# Altium project Monitor_Board_Model_H201.PrjPcb (part 2 of 3)

## Sheet Membrane_Keypad.SchDoc: Membrane Keypad Interface
size A4; DocumentNumber: 13; SheetNumber: 13; SheetTotal: 31
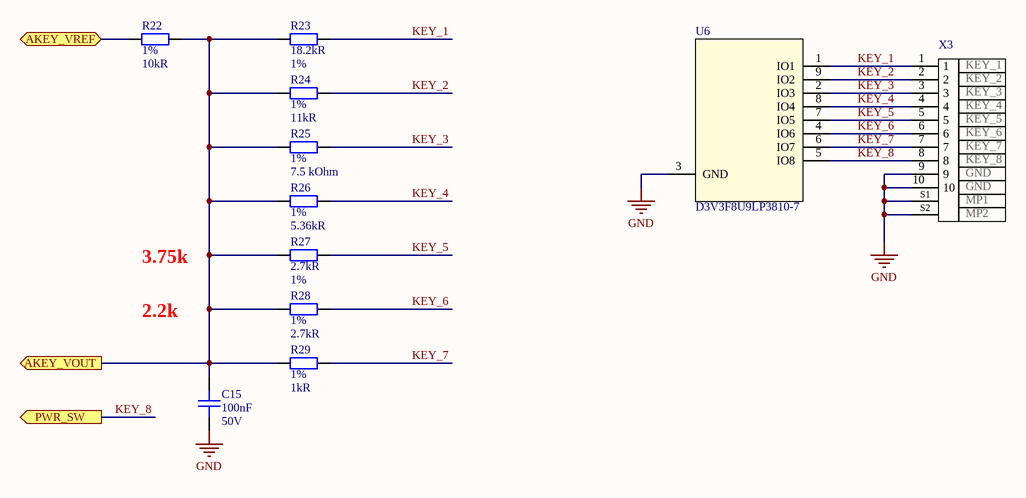
[diagram p5: Membrane_Keypad.SchDoc]

### Parts
(Parts that share a designator on the sheet are numbered #1, #2 ... from top to bottom, then left to right.)
C15  Capacitance: 100nF  Voltage: 50V  [C0402]  (hidden comment: CAP CER 0.1UF 50V X7R 0402)
R22  Tolerance: 1%  Resistance: 10kR  [0402R]  (hidden comment: RES SMD 10K OHM 1% 1/16W 0402)
R23  Resistance: 18.2kR  Tolerance: 1%  [R_0402]  (hidden comment: RES SMD 18.2K OHM 1% 1/16W 0402)
R24  Tolerance: 1%  Resistance: 11kR  [R_0402]  (hidden comment: RES SMD 11K OHM 1% 1/16W 0402)
R25  Tolerance: 1%  Resistance: 7.5 kOhm  [R0603]  (hidden comment: RES SMD 7.5K OHM 1% 1/10W 0603)
R26  Tolerance: 1%  Resistance: 5.36kR  [R0402]  (hidden comment: RES SMD 5.36K OHM 1% 1/16W 0402)
R27  Resistance: 2.7kR  Tolerance: 1%  [R0402]  (hidden comment: RC0402FR-072K7L)
R28  Tolerance: 1%  Resistance: 2.7kR  [R0402]  (hidden comment: RES SMD 2.7K OHM 1% 1/16W 0402)
R29  Tolerance: 1%  Resistance: 1kR  [R0402]  (hidden comment: RES SMD 1K OHM 1% 1/16W 0402)
U6#1  D3V3F8U9LP3810-7  [U-DFN3810-9]
X3  pin_7: KEY_7  pin_1: KEY_1  pin_2: KEY_2  pin_3: KEY_3  pin_4: KEY_4  pin_5: KEY_5  pin_6: KEY_6  pin_8: KEY_8  pin_MP2: MP2  pin_MP1: MP1  pin_9: GND  [MOLEX_5034801000]  (hidden comment: CONN 5034801000 FFC FPC 10POS 0.50MM R/A)

### Ports
AKEY_VOUT (out), AKEY_VREF, PWR_SW (out)

### Nets
GND: C15.1 U6#1.3(GND) X3.9 X3.10 X3.S1(MP1) X3.S2(MP2)
1V8_VDD: R22.2 ; port AKEY_VREF
ADCIN: C15.2 R22.1 R23.1 R24.1 R25.1 R26.1 R27.1 R28.1 R29.1 ; port AKEY_VOUT
KEY_1: R23.2 U6#1.1(IO1) X3.1
KEY_2: R24.2 U6#1.9(IO2) X3.2
KEY_3: R25.2 U6#1.2(IO3) X3.3
KEY_4: R26.2 U6#1.8(IO4) X3.4
KEY_5: R27.2 U6#1.7(IO5) X3.5
KEY_6: R28.2 U6#1.4(IO6) X3.6
KEY_7: R29.2 U6#1.6(IO7) X3.7
KEY_8: U6#1.5(IO8) X3.8 ; port PWR_SW  [project net ~{MR}]

### Notes on the sheet
- 3.75k
- 2.2k
- Title
- Size:
- Date:
- A4
- Number:
- Time:
- Revision:
- Sheet
- of
- File:

### Library data of the parts
C15 = CAP CER 0.1UF 50V X7R 0402: 0.1µF ±10% 50V Ceramic Capacitor X7R 0402 (1005 Metric); Manufacturer: TDK; Manufacturer Part Number: CGA2B3X7R1H104K050BB; Supplier 1: Digi-Key; Stock 1: 2925303; Pricing 1: 1=0.17, 10=0.118, 50=0.0668, 100=0.0553, 500=0.0388, 1000=0.0321, 2500=0.0299, 5000=0.0273 (USD); Mount: Surface Mount; Case/Package: 0402; Weight: 2.3E-05oz; Case Code (Metric): 1005; Case Code (Imperial): 0402; Min Operating Temperature: -55°C; Max Operating Temperature: 125°C; Voltage Rating: 50V; Tolerance: 10%; Packaging: Tape and Reel; Package Quantity: 1; Voltage Rating (DC): 50V; Dielectric: X7R; Termination: SMD/SMT; Composition: Ceramic; Length: 1mm; Height: 0.5mm; Width: 0.02inch; Thickness: 0.022inch; Depth: 0.5mm; Ratings: AEC-Q200; REACH SVHC: No SVHC; Lead Free: Lead Free; ComponentLink1URL: http://product.tdk.com/capacitor/mlcc/en/documents/mlccspec_automotive_general_midvoltage_en.pdf?src-supplier=Future+Electronics; ComponentLink1Description: http://product.tdk.com/capacitor/mlcc/en/documents/mlccspec_automotive_general_midvoltage_en.pdf?src-supplier=Future+Electronics; ComponentLink2URL: http://www.farnell.com/datasheets/1807242.pdf?src-supplier=Element14; ComponentLink2Description: http://www.farnell.com/datasheets/1807242.pdf?src-supplier=Element14; ComponentLink3URL: http://www.mouser.com/ds/2/400/lcc_automotive_general_en-843974.pdf?src-supplier=Mouser; ComponentLink3Description: http://www.mouser.com/ds/2/400/lcc_automotive_general_en-843974.pdf?src-supplier=Mouser; ComponentLink4URL: http://www.farnell.com/datasheets/1936565.pdf?src-supplier=Element14; ComponentLink4Description: http://www.farnell.com/datasheets/1936565.pdf?src-supplier=Element14; ComponentLink5URL: http://www.farnell.com/datasheets/1735392.pdf?src-supplier=Element14; ComponentLink5Description: http://www.farnell.com/datasheets/1735392.pdf?src-supplier=Element14; Supplier Part Number 1: 445-6899-1-ND
R22 = RES SMD 10K OHM 1% 1/16W 0402: 10 kOhms ±1% 0.063W, 1/16W Chip Resistor 0402 (1005 Metric) Moisture Resistant Thick Film; Manufacturer: Yageo; Manufacturer Part Number: RC0402FR-0710KP; Temperature Coefficient: 150ppm/°C; Max Power Dissipation: 63mW; Supplier 1: Digi-Key; Stock 1: 839368; Pricing 1: 1=0.1, 10=0.035, 100=0.014, 1000=0.0063, 2500=0.0055, 5000=0.0045 (USD); Case Code (Metric): 1005; Case Code (Imperial): 0402; Min Operating Temperature: -55°C; Max Operating Temperature: 155°C; Packaging: Tape and Reel; Composition: Thick Film; Number of Terminations: 2; Features: Moisture Resistant; Length: 0.039inch; Height: 0.016inch; Width: 0.02inch; ComponentLink1URL: http://www.yageo.com/NewPortal/yageodocoutput?fileName=/pdf/R-Chip/PYu-RC_51_RoHS_P_0.pdf&src-supplier=Digi-Key; ComponentLink1Description: http://www.yageo.com/NewPortal/yageodocoutput?fileName=/pdf/R-Chip/PYu-RC_51_RoHS_P_0.pdf&src-supplier=Digi-Key; Supplier Part Number 1: YAG1249CT-ND; Case/Package: 0402
R23 = RES SMD 18.2K OHM 1% 1/16W 0402: 18.2 kOhms ±1% 0.063W, 1/16W Chip Resistor 0402 (1005 Metric) Moisture Resistant Thick Film; Manufacturer: Yageo; Manufacturer Part Number: RC0402FR-0718K2L; Power Rating: 62.5mW; Temperature Coefficient: 100ppm/°C; Max Power Dissipation: 63mW; Voltage Rating (DC): 50V; Supplier 1: Digi-Key; Stock 1: 372233; Pricing 1: 1=0.1, 10=0.015, 100=0.0062, 1000=0.0028, 2500=0.0024, 5000=0.002 (USD); Case/Package: 0402; Case Code (Imperial): 0402; Case Code (Metric): 1005; Min Operating Temperature: -55°C; Max Operating Temperature: 155°C; Packaging: Tape and Reel; Composition: Thick Film; Number of Terminations: 2; Military Standard: Not; Features: Moisture Resistant; Length: 1mm; Height: 0.016inch; Width: 0.02inch; Depth: 0.5mm; Lead Free: Lead Free; ComponentLink1URL: http://www.yageo.com/documents/recent/PYu-RC0402_51_RoHS_L_6_r.pdf?src-supplier=Future+Electronics; ComponentLink1Description: http://www.yageo.com/documents/recent/PYu-RC0402_51_RoHS_L_6_r.pdf?src-supplier=Future+Electronics; ComponentLink2URL: http://www.yageo.com.tw/exep/pages/download/literatures/PYu-R_INT-thick_7.pdf?src-supplier=Digi-Key; ComponentLink2Description: http://www.yageo.com.tw/exep/pages/download/literatures/PYu-R_INT-thick_7.pdf?src-supplier=Digi-Key; ComponentLink3URL: http://www.mouser.com/ds/2/447/PYu-RC0402_51_RoHS_L_6_r-8721.pdf?src-supplier=Mouser; ComponentLink3Description: http://www.mouser.com/ds/2/447/PYu-RC0402_51_RoHS_L_6_r-8721.pdf?src-supplier=Mouser; Supplier Part Number 1: YAG2371CT-ND; Contact Plating: Tin,Lead,Matte; Package Quantity: 10000; Voltage Rating: 50V; Termination: SMD/SMT; Working Voltage: 50V; Radiation Hardening: No; ComponentLink4URL: http://www.yageo.com/documents/recent/PYu-RC0402_51_RoHS_L_6.pdf?src-supplier=Avnet+Europe; ComponentLink4Description: http://www.yageo.com/documents/recent/PYu-RC0402_51_RoHS_L_6.pdf?src-supplier=Avnet+Europe
R24 = RES SMD 11K OHM 1% 1/16W 0402: 11 kOhms ±1% 0.063W, 1/16W Chip Resistor 0402 (1005 Metric) Moisture Resistant Thick Film; Manufacturer: Yageo; Manufacturer Part Number: RC0402FR-0711KL; Power Rating: 63mW; Voltage Rating: 50V; Temperature Coefficient: 100ppm/°C; Supplier 1: Digi-Key; Stock 1: 632376; Pricing 1: 1=0.1, 10=0.015, 100=0.0062, 1000=0.0028, 2500=0.0024, 5000=0.002 (USD); Case Code (Imperial): 0402; Case Code (Metric): 1005; Min Operating Temperature: -55°C; Max Operating Temperature: 155°C; Packaging: Tape and Reel; Composition: Thick Film; Number of Terminations: 2; Termination: SMD/SMT; Military Standard: Not; Max Power Dissipation: 63mW; Voltage Rating (DC): 50V; Features: Moisture Resistant; Length: 0.039inch; Height: 0.016inch; Width: 0.02inch; Depth: 0.5mm; Lead Free: Lead Free; ComponentLink1URL: http://www.yageo.com/documents/recent/PYu-RC_Group_51_RoHS_L_10.pdf?src-supplier=Digi-Key; ComponentLink1Description: http://www.yageo.com/documents/recent/PYu-RC_Group_51_RoHS_L_10.pdf?src-supplier=Digi-Key; ComponentLink2URL: http://www.yageo.com/documents/recent/PYu-RC_Group_51_RoHS_L_9.pdf?src-supplier=Digi-Key; ComponentLink2Description: http://www.yageo.com/documents/recent/PYu-RC_Group_51_RoHS_L_9.pdf?src-supplier=Digi-Key; Supplier Part Number 1: 311-11.0KLRCT-ND; Case/Package: 0402; ComponentLink3URL: http://www.mouser.com/ds/2/447/PYu-RC0402_51_RoHS_L_6_r-8721.pdf?src-supplier=Mouser; ComponentLink3Description: http://www.mouser.com/ds/2/447/PYu-RC0402_51_RoHS_L_6_r-8721.pdf?src-supplier=Mouser; ComponentLink4URL: http://www.farnell.com/datasheets/1018594.pdf?src-supplier=Farnell; ComponentLink4Description: http://www.farnell.com/datasheets/1018594.pdf?src-supplier=Farnell; Number of Pins: 2; Package Quantity: 1; REACH SVHC: No SVHC
R25 = RES SMD 7.5K OHM 1% 1/10W 0603: 7.5 kOhms ±1% 0.1W, 1/10W Chip Resistor 0603 (1608 Metric) Moisture Resistant Thick Film; Manufacturer: Yageo; Manufacturer Part Number: RC0603FR-077K5L; Power Rating: 100mW; Voltage Rating: 50V; Temperature Coefficient: 100ppm/°C; Working Voltage: 75V; Supplier 1: Digi-Key; Stock 1: 1778854; Pricing 1: 1=0.1, 10=0.023, 100=0.0094, 1000=0.0042, 2500=0.0037 (USD); Case/Package: 0603; Number of Pins: 2; Case Code (Imperial): 0603; Case Code (Metric): 1608; Min Operating Temperature: -55°C; Max Operating Temperature: 155°C; Packaging: Tape and Reel; Package Quantity: 1; Termination: SMD/SMT; Number of Terminations: 2; Max Power Dissipation: 100mW; Features: Moisture Resistant; Voltage Rating (DC): 50V; Length: 1.6mm; Height: 0.45mm; Width: 0.031inch; Depth: 0.8mm; REACH SVHC: No SVHC; Military Standard: Not; Lead Free: Lead Free; ComponentLink1URL: http://www.yageo.com/documents/recent/PYu-RC_Group_51_RoHS_L_10.pdf?src-supplier=Digi-Key; ComponentLink1Description: http://www.yageo.com/documents/recent/PYu-RC_Group_51_RoHS_L_10.pdf?src-supplier=Digi-Key; ComponentLink2URL: http://www.mouser.com/catalog/specsheets/RC0603.pdf?src-supplier=Mouser; ComponentLink2Description: http://www.mouser.com/catalog/specsheets/RC0603.pdf?src-supplier=Mouser; ComponentLink3URL: http://www.farnell.com/datasheets/443971.pdf?src-supplier=Element14; ComponentLink3Description: http://www.farnell.com/datasheets/443971.pdf?src-supplier=Element14; ComponentLink4URL: https://www.verical.com/server-webapp/html/getDatasheet?partID=326523&src-supplier=Verical; ComponentLink4Description: https://www.verical.com/server-webapp/html/getDatasheet?partID=326523&src-supplier=Verical; Supplier Part Number 1: 311-7.50KHRCT-ND; Composition: Thick Film
R26 = RES SMD 5.36K OHM 1% 1/16W 0402: 5.36 kOhms ±1% 0.063W, 1/16W Chip Resistor 0402 (1005 Metric) Moisture Resistant Thick Film; Manufacturer: Yageo; Manufacturer Part Number: RC0402FR-075K36L; Temperature Coefficient: 100ppm/°C; Max Power Dissipation: 63mW; Power Rating: 62.5mW; Voltage Rating: 50V; Supplier 1: Digi-Key; Stock 1: 170749; Pricing 1: 1=0.1, 10=0.016, 100=0.0064, 1000=0.0029, 2500=0.0025, 5000=0.0021 (USD); Case Code (Metric): 1005; Case Code (Imperial): 0402; Min Operating Temperature: -55°C; Max Operating Temperature: 155°C; Packaging: Tape and Reel; Composition: Thick Film; Number of Terminations: 2; Features: Moisture Resistant; Length: 1mm; Height: 0.016inch; Width: 0.02inch; ComponentLink1URL: https://www.verical.com/server-webapp/html/getDatasheet?partID=314179&src-supplier=Verical; ComponentLink1Description: https://www.verical.com/server-webapp/html/getDatasheet?partID=314179&src-supplier=Verical; Supplier Part Number 1: 311-5.36KLRCT-ND; Case/Package: 0402; Contact Plating: Tin,Lead,Matte; Package Quantity: 1; Termination: SMD/SMT; Military Standard: Not; Voltage Rating (DC): 50V; Depth: 0.5mm; Radiation Hardening: No; Lead Free: Lead Free; ComponentLink2URL: http://www.yageo.com/pdf/PYu-RC0402_51_RoHS_L_4.pdf?src-supplier=Avnet; ComponentLink2Description: http://www.yageo.com/pdf/PYu-RC0402_51_RoHS_L_4.pdf?src-supplier=Avnet; ComponentLink3URL: http://www.yageo.com/documents/recent/PYu-RC_Group_51_RoHS_L_10.pdf?src-supplier=Digi-Key; ComponentLink3Description: http://www.yageo.com/documents/recent/PYu-RC_Group_51_RoHS_L_10.pdf?src-supplier=Digi-Key; ComponentLink4URL: http://www.yageo.com/documents/recent/PYu-RC0402_51_RoHS_L_6_r.pdf?src-supplier=Mouser; ComponentLink4Description: http://www.yageo.com/documents/recent/PYu-RC0402_51_RoHS_L_6_r.pdf?src-supplier=Mouser; ComponentLink5URL: http://www.yageo.com/documents/recent/PYu-RC0402_51_RoHS_L_6.pdf?src-supplier=Avnet+Europe; ComponentLink5Description: http://www.yageo.com/documents/recent/PYu-RC0402_51_RoHS_L_6.pdf?src-supplier=Avnet+Europe
R27 = RES SMD 2.7K OHM 1% 1/16W 0402: 2.7 kOhms ±1% 0.063W, 1/16W Chip Resistor 0402 (1005 Metric) Moisture Resistant Thick Film; Manufacturer: Yageo; Max Power Dissipation: 63mW; Temperature Coefficient: 100ppm/°C; Voltage Rating: 50V; Supplier 1: Digi-Key; Manufacturer Part Number: RC0402FR-072K7L; Stock 1: 261850; Pricing 1: 1=0.1, 10=0.016, 100=0.0064, 1000=0.0029, 2500=0.0025, 5000=0.0021 (USD); Case/Package: 0402; Case Code (Metric): 1005; Case Code (Imperial): 0402; Min Operating Temperature: -55°C; Max Operating Temperature: 155°C; Packaging: Tape and Reel; Composition: Thick Film; Number of Terminations: 2; Features: Moisture Resistant; Length: 1mm; Height: 0.016inch; Width: 0.02inch; ComponentLink1URL: http://www.mouser.com/ds/2/447/PYu-RC0402_51_RoHS_L_6_r-8721.pdf?src-supplier=Mouser; ComponentLink1Description: http://www.mouser.com/ds/2/447/PYu-RC0402_51_RoHS_L_6_r-8721.pdf?src-supplier=Mouser; ComponentLink2URL: http://www.yageo.com/documents/recent/PYu-RC_Group_51_RoHS_L_9.pdf?src-supplier=Digi-Key; ComponentLink2Description: http://www.yageo.com/documents/recent/PYu-RC_Group_51_RoHS_L_9.pdf?src-supplier=Digi-Key; Supplier Part Number 1: 311-2.70KLRCT-ND; Package Quantity: 1; Power Rating: 63mW; Termination: SMD/SMT; Military Standard: Not; Depth: 0.5mm; Lead Free: Lead Free; ComponentLink3URL: http://www.yageo.com/documents/recent/PYu-RC_Group_51_RoHS_L_10.pdf?src-supplier=Digi-Key; ComponentLink3Description: http://www.yageo.com/documents/recent/PYu-RC_Group_51_RoHS_L_10.pdf?src-supplier=Digi-Key; Working Voltage: 50V; REACH SVHC: Unknown; ComponentLink4URL: http://www.farnell.com/datasheets/2167052.pdf?src-supplier=Element14; ComponentLink4Description: http://www.farnell.com/datasheets/2167052.pdf?src-supplier=Element14
R28 = RES SMD 2.7K OHM 1% 1/16W 0402: 2.7 kOhms ±1% 0.063W, 1/16W Chip Resistor 0402 (1005 Metric) Moisture Resistant Thick Film; Manufacturer: Yageo; Manufacturer Part Number: RC0402FR-072K7L; Temperature Coefficient: 100ppm/°C; Max Power Dissipation: 63mW; Voltage Rating: 50V; Supplier 1: Digi-Key; Stock 1: 261850; Pricing 1: 1=0.1, 10=0.016, 100=0.0064, 1000=0.0029, 2500=0.0025, 5000=0.0021 (USD); Case/Package: 0402; Case Code (Metric): 1005; Case Code (Imperial): 0402; Min Operating Temperature: -55°C; Max Operating Temperature: 155°C; Packaging: Tape and Reel; Composition: Thick Film; Number of Terminations: 2; Features: Moisture Resistant; Length: 1mm; Height: 0.016inch; Width: 0.02inch; ComponentLink1URL: http://www.mouser.com/ds/2/447/PYu-RC0402_51_RoHS_L_6_r-8721.pdf?src-supplier=Mouser; ComponentLink1Description: http://www.mouser.com/ds/2/447/PYu-RC0402_51_RoHS_L_6_r-8721.pdf?src-supplier=Mouser; ComponentLink2URL: http://www.yageo.com/documents/recent/PYu-RC_Group_51_RoHS_L_9.pdf?src-supplier=Digi-Key; ComponentLink2Description: http://www.yageo.com/documents/recent/PYu-RC_Group_51_RoHS_L_9.pdf?src-supplier=Digi-Key; Supplier Part Number 1: 311-2.70KLRCT-ND; Power Rating: 63mW; Package Quantity: 1; Termination: SMD/SMT; Military Standard: Not; Working Voltage: 50V; Depth: 0.5mm; REACH SVHC: Unknown; Lead Free: Lead Free; ComponentLink3URL: http://www.yageo.com/documents/recent/PYu-RC_Group_51_RoHS_L_10.pdf?src-supplier=Digi-Key; ComponentLink3Description: http://www.yageo.com/documents/recent/PYu-RC_Group_51_RoHS_L_10.pdf?src-supplier=Digi-Key; ComponentLink4URL: http://www.farnell.com/datasheets/2167052.pdf?src-supplier=Element14; ComponentLink4Description: http://www.farnell.com/datasheets/2167052.pdf?src-supplier=Element14
R29 = RES SMD 1K OHM 1% 1/16W 0402: 1 kOhms ±1% 0.063W, 1/16W Chip Resistor 0402 (1005 Metric) Moisture Resistant Thick Film; Manufacturer: Yageo; Manufacturer Part Number: RC0402FR-071KL; Temperature Coefficient: 100ppm/°C; Power Rating: 62.5mW; Voltage Rating: 50V; Supplier 1: Digi-Key; Stock 1: 9574509; Pricing 1: 1=0.1, 10=0.015, 100=0.0062, 1000=0.0028, 2500=0.0024, 5000=0.002 (USD); Case/Package: 0402; Case Code (Imperial): 0402; Case Code (Metric): 1005; Min Operating Temperature: -55°C; Max Operating Temperature: 155°C; Packaging: Tape and Reel; Composition: Thick Film; Termination: SMD/SMT; Military Standard: Not; Length: 1mm; Height: 0.32mm; Width: 0.5mm; Depth: 0.5mm; REACH SVHC: Unknown; Lead Free: Lead Free; ComponentLink1URL: http://www.mouser.com/ds/2/447/PYu-RC0402_51_RoHS_L_6_r-8721.pdf?src-supplier=Mouser; ComponentLink1Description: http://www.mouser.com/ds/2/447/PYu-RC0402_51_RoHS_L_6_r-8721.pdf?src-supplier=Mouser; ComponentLink2URL: http://documents.rs-components.com/techlib://itc_doclist_GB.htm?stockno=6186122&src-supplier=RSComponents; ComponentLink2Description: http://documents.rs-components.com/techlib://itc_doclist_GB.htm?stockno=6186122&src-supplier=RSComponents; ComponentLink3URL: http://www.farnell.com/datasheets/1018594.pdf?src-supplier=Element14; ComponentLink3Description: http://www.farnell.com/datasheets/1018594.pdf?src-supplier=Element14; ComponentLink4URL: http://www.yageo.com/documents/recent/PYu-RC0402_51_RoHS_L_6_r.pdf?src-supplier=Future+Electronics; ComponentLink4Description: http://www.yageo.com/documents/recent/PYu-RC0402_51_RoHS_L_6_r.pdf?src-supplier=Future+Electronics; ComponentLink5URL: http://www.farnell.com/datasheets/2167052.pdf?src-supplier=Element14; ComponentLink5Description: http://www.farnell.com/datasheets/2167052.pdf?src-supplier=Element14; Supplier Part Number 1: 311-1.00KLRCT-ND; Number of Pins: 2; Voltage Rating (DC): 50V
U6#1 = TVS DIODE PP U-DFN3810-9: 5V (Typ) Clamp 5A (8/20µs) Ipp Tvs Diode Surface Mount U-DFN3810-9; Manufacturer: Diodes; Supplier 1: Digi-Key; Manufacturer Part Number: D3V3F8U9LP3810-7; Stock 1: 14880; Pricing 1: 1=0.42, 10=0.317, 100=0.1508, 500=0.1336, 1000=0.104 (USD); Supplier Part Number 1: D3V3F8U9LP3810-7DICT-ND
X3 = CONN 5034801000 FFC FPC 10POS 0.50MM R/A: 10 Position FFC, FPC Connector Contacts, Top and Bottom 0.020" (0.50mm) Surface Mount, Right Angle; Manufacturer: Molex; Manufacturer Part Number: 503480-1000; Pitch: 0.5mm; Actuator Material: Nylon,Glass,Polyamide; Wire/Cable Type: Straight; Number of Positions: 10; Current Rating: 500mA; Actuator Color: Black; Voltage Rating (AC): 50V; Gender: Receptacle; Stackable: No; ComponentLink1Description: https://www.verical.com/server-webapp/html/getDatasheet?partID=735332&src-supplier=Verical; ComponentLink1URL: https://www.verical.com/server-webapp/html/getDatasheet?partID=735332&src-supplier=Verical; ComponentLink2Description: http://www.mouser.com/ds/2/276/5034801000_FFC_FPC_CONNECTORS-179433.pdf?src-supplier=Mouser; ComponentLink2URL: http://www.mouser.com/ds/2/276/5034801000_FFC_FPC_CONNECTORS-179433.pdf?src-supplier=Mouser; Packaging: Tape and Reel; Length: 6.7mm; Supplier 1: Digi-Key; Stock 1: 36029; Pricing 1: 1=0.89, 10=0.738, 100=0.6148, 1000=0.4918 (USD); Contact Material: Bronze; Contact Plating: Gold; Housing Material: Polymer; Housing Color: White; Min Operating Temperature: -40°C; Max Operating Temperature: 85°C; Termination: Solder; Mating Cycles: 10; Flammability Rating: UL94 V-0; ComponentLink3URL: http://www.molex.com/webdocs/datasheets/pdf/en-us/5034801000_FFC_FPC_CONNECTORS.pdf?src-supplier=Avnet+Europe; ComponentLink3Description: http://www.molex.com/webdocs/datasheets/pdf/en-us/5034801000_FFC_FPC_CONNECTORS.pdf?src-supplier=Avnet+Europe; Supplier Part Number 1: WM1389CT-ND; ComponentLink4URL: https://www.molex.com/pdm_docs/pk/SPK-503480-001.pdf?src-supplier=Digi-Key; ComponentLink4Description: https://www.molex.com/pdm_docs/pk/SPK-503480-001.pdf?src-supplier=Digi-Key; Material: Bronze; Package Quantity: 1; Number of Rows: 1; Voltage Rating: 50V; Max Voltage Rating (AC): 50V; Number of Contacts: 10; Max Voltage Rating (DC): 50V; Orientation: Right Angle; Number of Circuits: 10; Series: BackFlip, Easy-On 503480; Depth: 3.6mm; Radiation Hardening: No; REACH SVHC: Unknown; Halogen Free: Low Halogen; ELV: Compliant; pin_10: GND

## Sheet Visual_User_Interface.SchDoc: User Interface
size A4; DocumentNumber: 15; SheetNumber: 15; SheetTotal: 31
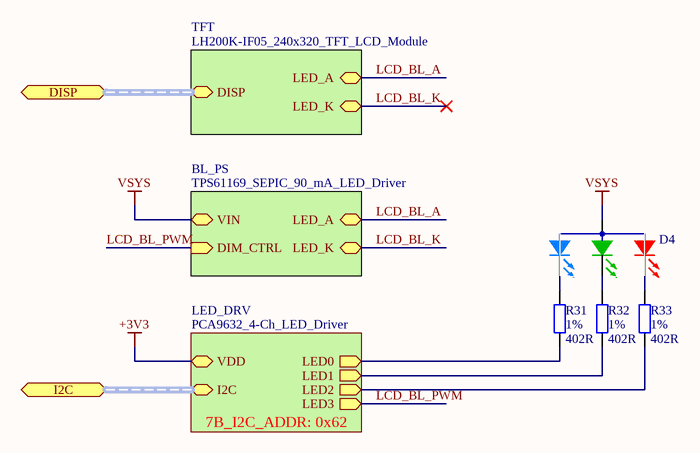
[diagram p6: Visual_User_Interface.SchDoc]

### Parts
(Parts that share a designator on the sheet are numbered #1, #2 ... from top to bottom, then left to right.)
D4  150066M153000  [LED_0606_RGB_WURTH]  (value not drawn)
R31#1  Tolerance: 1%  Resistance: 402R  [R0402]  (hidden comment: RES SMD 402 OHM 1% 1/16W 0402)
R32#1  Tolerance: 1%  Resistance: 402R  [R0402]  (hidden comment: RES SMD 402 OHM 1% 1/16W 0402)
R33  Tolerance: 1%  Resistance: 402R  [R0402]  (hidden comment: RES SMD 402 OHM 1% 1/16W 0402)

### Sub-sheets
BL_PS = TPS61169_SEPIC_90_mA_LED_Driver (file not in this document): VIN, LED_K, DIM_CTRL (in), LED_A
LED_DRV = PCA9632_4-Ch_LED_Driver (file not in this document): VDD, LED0 (out), LED1 (out), LED2 (out), LED3 (out), I2C (harness I2C)  | 7B_I2C_ADDR: 0x62
TFT = LH200K-IF05_240x320_TFT_LCD_Module (file not in this document): DISP (harness DISP_SPI), LED_K, LED_A

### Ports
DISP (harness DISP_SPI), I2C (harness I2C)

### Nets
VSYS: D4.A ; sheet BL_PS/VIN
LCD_BL_A: sheet BL_PS/LED_A, sheet TFT/LED_A
LCD_BL_K: sheet BL_PS/LED_K, sheet TFT/LED_K
LCD_BL_PWM: sheet LED_DRV/LED3, sheet BL_PS/DIM_CTRL
NetD4_BK: D4.BK R31#1.2
NetD4_GK: D4.GK R32#1.2
NetD4_RK: D4.RK R33.2
NetR31#1_1: R31#1.1 ; sheet LED_DRV/LED0
NetR32#1_1: R32#1.1 ; sheet LED_DRV/LED1
NetR33_1: R33.1 ; sheet LED_DRV/LED2

### Buses and harness runs
harness port DISP = sheet TFT/DISP
harness port I2C = sheet LED_DRV/I2C

### Notes on the sheet
- Title
- Size:
- Date:
- A4
- Number:
- Time:
- Revision:
- Sheet
- of
- File:

### Library data of the parts
D4 = LED RGB DIFFUSED SMD: Red, Green, Blue (RGB) 624nm Red, 525nm Green, 470nm Blue LED Indication - Discrete 2V Red, 3.3V Green, 3.3V Blue 0606 (1616 Metric); Manufacturer: Wurth Electronics; Color: Blue,Green,Red; Lens Style: Flat; Luminous Intensity: 180mcd; Test Current: 20mA; Viewing Angle: 120°; Element Configuration: Common Anode; Lens Size: 1.6mm; Supplier 1: Digi-Key; Manufacturer Part Number: 150066M153000; Stock 1: 7810; Pricing 1: 1=0.51, 50=0.415, 100=0.298, 500=0.272 (USD); Mount: Surface Mount; Case/Package: 0606; Case Code (Imperial): 0606; Case Code (Metric): 1616; Packaging: Tape and Reel; Lens Transparency: Diffused; Forward Voltage: 3.3V; Dominant Wavelength: 470nm; Length: 1.6mm; Height: 0.5mm; Width: 1.6mm; ComponentLink1URL: https://katalog.we-online.de/led/datasheet/150066M153000.pdf?src-supplier=Digi-Key; ComponentLink1Description: https://katalog.we-online.de/led/datasheet/150066M153000.pdf?src-supplier=Digi-Key; ComponentLink2URL: http://www.farnell.com/datasheets/2301702.pdf?src-supplier=Farnell; ComponentLink2Description: http://www.farnell.com/datasheets/2301702.pdf?src-supplier=Farnell; ComponentLink3URL: http://www.farnell.com/datasheets/2301702.pdf?src-supplier=Newark; ComponentLink3Description: http://www.farnell.com/datasheets/2301702.pdf?src-supplier=Newark; ComponentLink4URL: http://www.farnell.com/datasheets/2301702.pdf?src-supplier=Element14; ComponentLink4Description: http://www.farnell.com/datasheets/2301702.pdf?src-supplier=Element14; Supplier Part Number 1: 732-11390-1-ND
R31#1 R32#1 R33 = RES SMD 402 OHM 1% 1/16W 0402: 402 Ohms ±1% 0.063W, 1/16W Chip Resistor 0402 (1005 Metric) Moisture Resistant Thick Film; Manufacturer: Yageo; Manufacturer Part Number: RC0402FR-07402RL; Value: 22k; Max Power Dissipation: 63mW; Temperature Coefficient: 100ppm/°C; Power Rating: 62.5mW; Voltage Rating: 50V; Supplier 1: Digi-Key; Stock 1: 0; Pricing 1: 1=0.1, 10=0.016, 100=0.0064, 1000=0.0029, 2500=0.0025, 5000=0.0021 (USD); Case/Package: 0402; Case Code (Metric): 1005; Case Code (Imperial): 0402; Min Operating Temperature: -55°C; Max Operating Temperature: 155°C; Packaging: Tape and Reel; Composition: Thick Film; Number of Terminations: 2; Features: Moisture Resistant; Length: 0.039inch; Height: 0.016inch; Width: 0.02inch; ComponentLink1URL: http://www.yageo.com/documents/recent/PYu-RC0402_51_RoHS_L_6.pdf?src-supplier=Avnet; ComponentLink1Description: http://www.yageo.com/documents/recent/PYu-RC0402_51_RoHS_L_6.pdf?src-supplier=Avnet; ComponentLink2URL: http://www.yageo.com/documents/recent/PYu-RC0402_51_RoHS_L_6.pdf?src-supplier=Avnet+Europe; ComponentLink2Description: http://www.yageo.com/documents/recent/PYu-RC0402_51_RoHS_L_6.pdf?src-supplier=Avnet+Europe; Supplier Part Number 1: YAG3152CT-ND; Contact Plating: Tin,Matte; Termination: SMD/SMT; Military Standard: Not; Depth: 0.5mm; Lead Free: Lead Free; ComponentLink3URL: http://www.mouser.com/ds/2/447/PYu-RC0402_51_RoHS_L_6_r-8721.pdf?src-supplier=Mouser; ComponentLink3Description: http://www.mouser.com/ds/2/447/PYu-RC0402_51_RoHS_L_6_r-8721.pdf?src-supplier=Mouser; Mount: Surface Mount

## Sheet Auxiliary.SchDoc: Auxiliary Components
size A4; DocumentNumber: 17; SheetNumber: 17; SheetTotal: 31
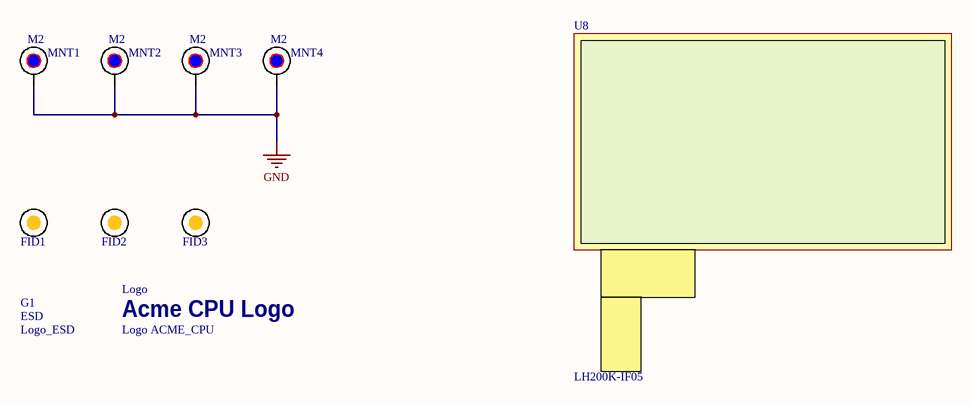
[diagram p7: Auxiliary.SchDoc]

### Parts
FID1  N/A  [Fiducial]  (value not drawn)  (no BOM)
FID2  N/A  [Fiducial]  (value not drawn)  (no BOM)
FID3  N/A  [Fiducial]  (value not drawn)  (no BOM)
G1  Logo_ESD  [Logo_ESD]  (no BOM)
Logo  Logo ACME_CPU  [LOGO_ACME_CPU]  (no BOM)
MNT1  MountHole M2. Nothing to buy or mount  [MountHole_M2]  (value not drawn)  (no BOM)
MNT2  MountHole M2. Nothing to buy or mount  [MountHole_M2]  (value not drawn)  (no BOM)
MNT3  MountHole M2. Nothing to buy or mount  [MountHole_M2]  (value not drawn)  (no BOM)
MNT4  MountHole M2. Nothing to buy or mount  [MountHole_M2]  (value not drawn)  (no BOM)
U8  LH200K-IF05  (mechanical)

### Nets
GND: MNT1.1 MNT2.1 MNT3.1 MNT4.1

### Notes on the sheet
- Title
- Size:
- Date:
- A4
- Number:
- Time:
- Revision:
- Sheet
- of
- File:
- (in symbol Logo ACME_CPU) Acme CPU Logo
- (in symbol Logo_ESD) ESD
- (in symbol MountHole_M2) M2

### Library data of the parts
FID1-FID3 = Fiducial: Fiducial mark.  There is nothing to buy or mount.; ClassName: FiducialMark; CompType: Fiducial; Manufacturer: N/A; MountType: N/A; PackageReference: Fiducial; Manufacturer Part Number: N/A
MNT1-MNT4 = MountHole_M2: PCB Mount Hole. There is nothing to buy or mount.
U8 = MOD LH200K-IF05 240x320 2-inch TFT LCD Display: 2” TFT LCD Display.; Manufacturer: Shenzhen Limito Technology Inc.; Mount: Not Mounted on PCB; Manufacturer Part Number: LH200K-IF05
Logo = Logo ACME_CPU: ClassName: PCB_FEATURE

## Sheet ESP32_MCU.SchDoc: ESP32-WROOM32D Module
size A4; DocumentNumber: 2; SheetNumber: 2; SheetTotal: 31
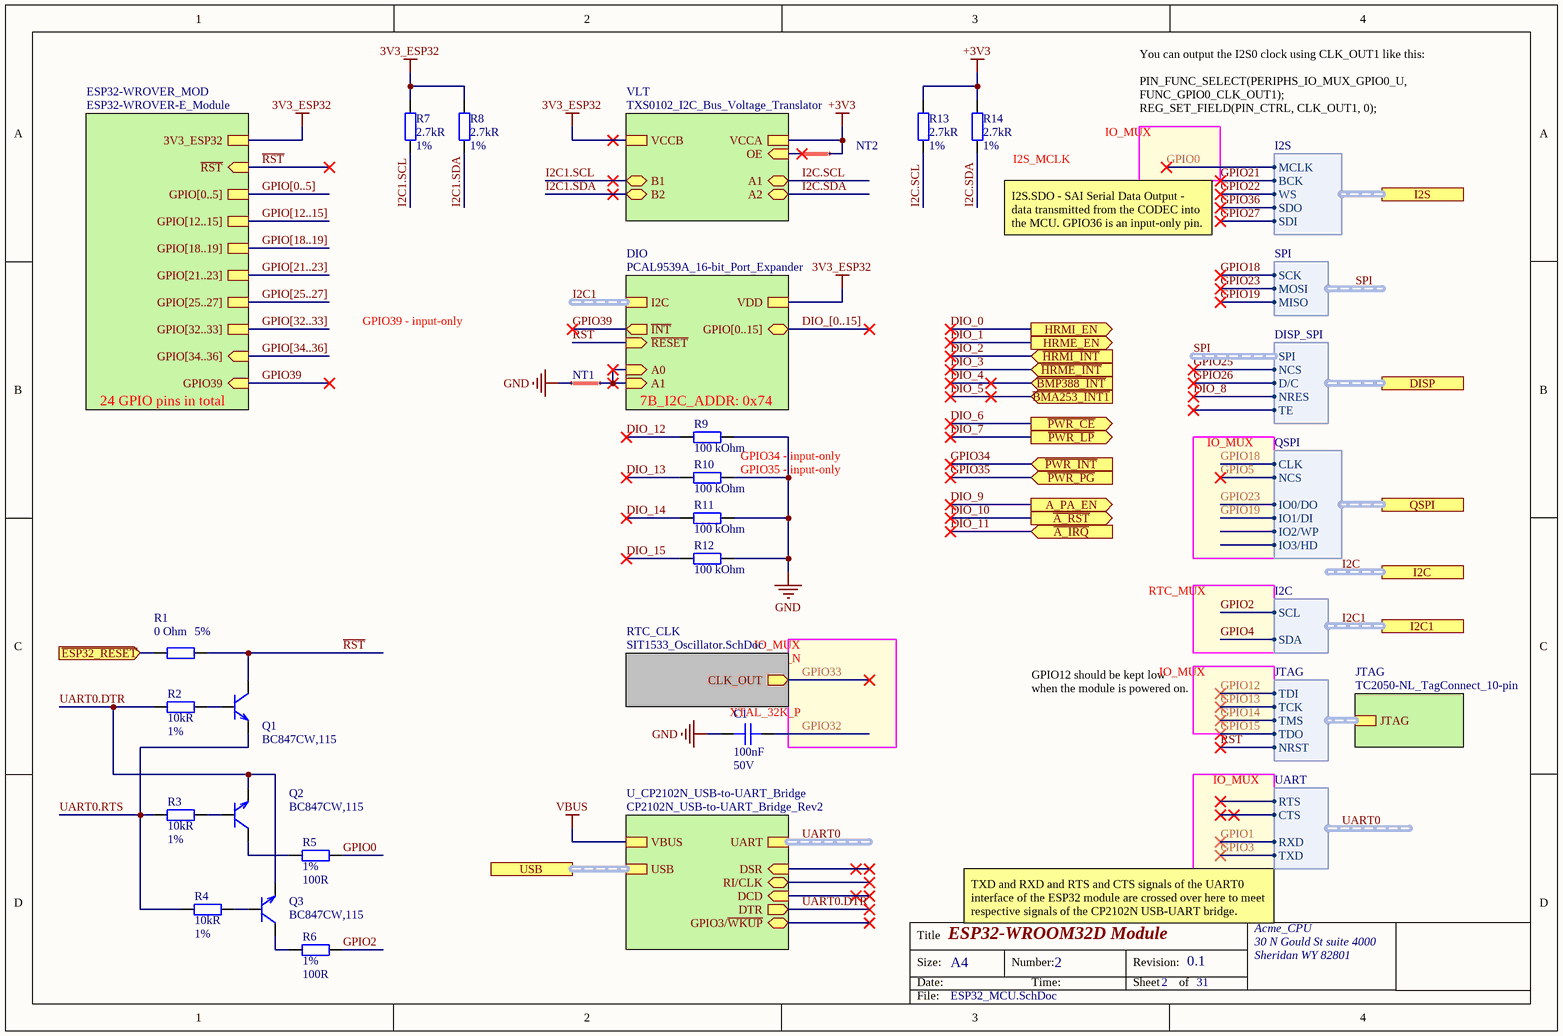
[diagram p8: ESP32_MCU.SchDoc]

### Parts
C1  Capacitance: 100nF  Voltage: 50V  [C0402]  (hidden comment: CAP CER 0.1UF 50V X7R 0402)
NT1  Net Tie  [Net Tie 6x30mil]  (value not drawn)  (net tie, no BOM)
NT2  Net Tie  [Net Tie 6x30mil]  (value not drawn)  (net tie, no BOM)
Q1  BC847CW,115  [SOT-323]
Q2  BC847CW,115  [SOT-323]
Q3  BC847CW,115  [SOT-323]
R1  Tolerance: 5%  Resistance: 0 Ohm  [R0402]  (hidden comment: RES SMD 0 OHM JUMPER 1/16W 0402)
R2  Resistance: 10kR  Tolerance: 1%  [R0402]  (hidden comment: RES SMD 10K OHM 1% 1/16W 0402)
R3  Resistance: 10kR  Tolerance: 1%  [R0402]  (hidden comment: RES SMD 10K OHM 1% 1/16W 0402)
R4  Resistance: 10kR  Tolerance: 1%  [R0402]  (hidden comment: RES SMD 10K OHM 1% 1/16W 0402)
R5  Tolerance: 1%  Resistance: 100R  [0402R]  (hidden comment: RES SMD 100 OHM 1% 1/16W 0402)
R6  Tolerance: 1%  Resistance: 100R  [0402R]  (hidden comment: RES SMD 100 OHM 1% 1/16W 0402)
R7  Resistance: 2.7kR  Tolerance: 1%  [R0402]  (hidden comment: RES SMD 2.7K OHM 1% 1/16W 0402)
R8  Resistance: 2.7kR  Tolerance: 1%  [R0402]  (hidden comment: RES SMD 2.7K OHM 1% 1/16W 0402)
R9  Resistance: 100 kOhm  [0402R]  (hidden comment: RES SMD 100K OHM 1% 1/16W 0402)
R10  Resistance: 100 kOhm  [0402R]  (hidden comment: RES SMD 100K OHM 1% 1/16W 0402)
R11  Resistance: 100 kOhm  [0402R]  (hidden comment: RES SMD 100K OHM 1% 1/16W 0402)
R12  Resistance: 100 kOhm  [0402R]  (hidden comment: RES SMD 100K OHM 1% 1/16W 0402)
R13  Resistance: 2.7kR  Tolerance: 1%  [R0402]  (hidden comment: RES SMD 2.7K OHM 1% 1/16W 0402)
R14  Resistance: 2.7kR  Tolerance: 1%  [R0402]  (hidden comment: RES SMD 2.7K OHM 1% 1/16W 0402)

### Sub-sheets
DIO = PCAL9539A_16-bit_Port_Expander (file not in this document): I2C (harness I2C), ~{RESET} (in), ~{INT} (out), A0 (in), A1 (in), VDD, GPIO[0..15] (bidir)  | 7B_I2C_ADDR: 0x74
ESP32-WROVER_MOD = ESP32-WROVER-E_Module (file not in this document): ~{RST} (in), GPIO[21..23], GPIO[25..27], GPIO[18..19], GPIO[12..15], GPIO39 (in), GPIO[0..5], 3V3_ESP32, GPIO[34..36] (in), GPIO[32..33]  | : 24 GPIO pins in total
JTAG = TC2050-NL_TagConnect_10-pin (file not in this document): JTAG (harness JTAG)  | Caption: JTAG
RTC_CLK = SIT1533_Oscillator.SchDoc: CLK_OUT (out)
U_CP2102N_USB-to-UART_Bridge = CP2102N_USB-to-UART_Bridge_Rev2 (file not in this document): GPIO3/~{WKUP} (bidir), UART (harness UART), DCD (in), RI/CLK (bidir), DTR (out), DSR (in), USB (harness USB), VBUS
VLT = TXS0102_I2C_Bus_Voltage_Translator (file not in this document): VCCA, VCCB, OE (in), A1 (bidir), A2 (bidir), B1 (bidir), B2 (bidir)

### Ports
A_PA_EN (out), DISP (harness DISP_SPI), HRME_EN (out), HRMI_EN (out), I2C1 (harness I2C), I2C (harness I2C), I2S (harness I2S), QSPI (harness QSPI), USB (harness USB), ~{A_IRQ} (in), ~{A_RST} (out), ~{BMA253_INT1} (in), ~{BMP388_INT} (in), ~{ESP32_RESET} (in), ~{HRME_INT} (in), ~{HRMI_INT} (in), ~{PWR_CE} (out), ~{PWR_INT} (in), ~{PWR_LP} (out), ~{PWR_PG} (in)

### Harnesses
I2C: SCL, SDA
UART: RTS, CTS, RXD, TXD
I2S: WS, SDI, BCK, SDO, MCLK
QSPI: IO0/DO, IO1/DI, NCS, CLK, IO2/WP, IO3/HD
JTAG: TDI, TMS, TCK, TDO, NRST
DISP_SPI: SPI, NCS, D/C, NRES, TE
SPI: SCK, MISO, MOSI

### Nets
3V3_ESP32: R7.2 R8.2 ; sheet ESP32-WROVER_MOD/3V3_ESP32, sheet DIO/VDD, sheet VLT/VCCB
+3V3: NT2.2 R13.2 R14.2 ; sheet VLT/VCCA
GND: C1.2 NT1.1 R9.2 R10.2 R11.2 R12.2
~{RST}: Q1.3(C) R1.2 ; sheet ESP32-WROVER_MOD/~{RST}, sheet DIO/~{RESET}, sheet JTAG/JTAG.NRST
~{RST}: R1.1 ; port ~{ESP32_RESET}  [a separate net that carries the same name]
DIO_0: port HRMI_EN
DIO_4: port ~{BMP388_INT}  [project net ~{BMP388_INT}]
DIO_5: port ~{BMA253_INT1}  [project net ~{BMA253_INT1}]
DIO_8: port DISP.NRES
DIO_9: port A_PA_EN  [project net A_PA_EN]
DIO_12: R9.1
DIO_13: R10.1
DIO_14: R11.1
DIO_15: R12.1
GPIO0: R5.1 ; port I2S.MCLK
GPIO1: sheet U_CP2102N_USB-to-UART_Bridge/UART.RXD
GPIO2: R6.1 ; port I2C1.SCL
GPIO3: sheet U_CP2102N_USB-to-UART_Bridge/UART.TXD
GPIO4: port I2C1.SDA
GPIO5: port QSPI.NCS
GPIO12: sheet JTAG/JTAG.TDI
GPIO13: sheet JTAG/JTAG.TCK
GPIO14: sheet JTAG/JTAG.TMS
GPIO15: sheet JTAG/JTAG.TDO
GPIO18: port QSPI.CLK, harness SPI.SCK
GPIO19: port QSPI.IO1/DI, harness SPI.MISO
GPIO21: port I2S.BCK
GPIO22: port I2S.WS
GPIO23: port QSPI.IO0/DO, harness SPI.MOSI
GPIO25: port DISP.NCS  [project net DISP.NCS]
GPIO26: port DISP.D/C  [project net DISP.D/C]
GPIO27: port I2S.SDI
GPIO32: C1.1
GPIO36: port I2S.SDO
GPIO39: sheet ESP32-WROVER_MOD/GPIO39, sheet DIO/~{INT}
I2C1.SCL: R7.1 ; sheet VLT/B1
I2C1.SDA: R8.1 ; sheet VLT/B2
I2C.SCL: R13.1 ; sheet VLT/A1
I2C.SDA: R14.1 ; sheet VLT/A2
UART0.DTR: Q2.2(E) Q3.2(E) R2.1 ; sheet U_CP2102N_USB-to-UART_Bridge/DTR
UART0.RTS: Q1.2(E) R3.1 R4.1
NetNT1_2: NT1.2 ; sheet DIO/A0, sheet DIO/A1
NetNT2_1: NT2.1 ; sheet VLT/OE
NetQ1_1: Q1.1(B) R2.2
NetQ2_1: Q2.1(B) R3.2
NetQ2_3: Q2.3(C) R5.2
NetQ3_1: Q3.1(B) R4.2
NetQ3_3: Q3.3(C) R6.2

### Buses and harness runs
bus DIO_[0..15] = sheet DIO/GPIO[0..15]
bus GPIO[0..5] = sheet ESP32-WROVER_MOD/GPIO[0..5]
bus GPIO[12..15] = sheet ESP32-WROVER_MOD/GPIO[12..15]
bus GPIO[18..19] = sheet ESP32-WROVER_MOD/GPIO[18..19]
bus GPIO[21..23] = sheet ESP32-WROVER_MOD/GPIO[21..23]
bus GPIO[25..27] = sheet ESP32-WROVER_MOD/GPIO[25..27]
bus GPIO[32..33] = sheet ESP32-WROVER_MOD/GPIO[32..33]
bus GPIO[34..36] = sheet ESP32-WROVER_MOD/GPIO[34..36]
harness I2C1 = port I2C1
harness I2C1 = sheet DIO/I2C
harness I2C = port I2C
harness port USB = sheet U_CP2102N_USB-to-UART_Bridge/USB
harness UART0 = sheet U_CP2102N_USB-to-UART_Bridge/UART

### Notes on the sheet
- I2S_MCLK
- You can output the I2S0 clock using CLK_OUT1 like this:
  PIN_FUNC_SELECT(PERIPHS_IO_MUX_GPIO0_U, FUNC_GPIO0_CLK_OUT1);
  REG_SET_FIELD(PIN_CTRL, CLK_OUT1, 0);
- IO_MUX
- (near R14) I2S.SDO - SAI Serial Data Output - data transmitted from the CODEC into the MCU. GPIO36 is an input-only pin.
- GPIO39 - input-only
- GPIO34 - input-only
- GPIO35 - input-only
- RTC_MUX
- (near C1) XTAL_32K_P
- XTAL_32K_N
- GPIO12 should be kept low when the module is powered on.
- TXD and RXD and RTS and CTS signals of the UART0 interface of the ESP32 module are crossed over here to meet respective signals of the CP2102N USB-UART bridge.
- Title
- Size:
- Date:
- A4
- Number:
- Time:
- Revision:
- Sheet
- of
- File:

### Library data of the parts
C1 = CAP CER 0.1UF 50V X7R 0402: as C15 on sheet Membrane_Keypad; Supplier 1: Digi-Key; Stock 1: 2925303; Pricing 1: 1=0.17, 10=0.118, 50=0.0668, 100=0.0553, 500=0.0388, 1000=0.0321, 2500=0.0299, 5000=0.0273 (USD); Mount: Surface Mount; Case/Package: 0402; Weight: 2.3E-05oz; Case Code (Metric): 1005; Case Code (Imperial): 0402; Min Operating Temperature: -55°C; Max Operating Temperature: 125°C; Voltage Rating: 50V; Tolerance: 10%; Packaging: Tape and Reel; Package Quantity: 1; Voltage Rating (DC): 50V; Dielectric: X7R; Termination: SMD/SMT; Composition: Ceramic; Length: 1mm; Height: 0.5mm; Width: 0.02inch; Thickness: 0.022inch; Depth: 0.5mm; Ratings: AEC-Q200; REACH SVHC: No SVHC; Lead Free: Lead Free; ComponentLink1URL: http://product.tdk.com/capacitor/mlcc/en/documents/mlccspec_automotive_general_midvoltage_en.pdf?src-supplier=Future+Electronics; ComponentLink1Description: http://product.tdk.com/capacitor/mlcc/en/documents/mlccspec_automotive_general_midvoltage_en.pdf?src-supplier=Future+Electronics; ComponentLink2URL: http://www.farnell.com/datasheets/1807242.pdf?src-supplier=Element14; ComponentLink2Description: http://www.farnell.com/datasheets/1807242.pdf?src-supplier=Element14; ComponentLink3URL: http://www.mouser.com/ds/2/400/lcc_automotive_general_en-843974.pdf?src-supplier=Mouser; ComponentLink3Description: http://www.mouser.com/ds/2/400/lcc_automotive_general_en-843974.pdf?src-supplier=Mouser; ComponentLink4URL: http://www.farnell.com/datasheets/1936565.pdf?src-supplier=Element14; ComponentLink4Description: http://www.farnell.com/datasheets/1936565.pdf?src-supplier=Element14; ComponentLink5URL: http://www.farnell.com/datasheets/1735392.pdf?src-supplier=Element14; ComponentLink5Description: http://www.farnell.com/datasheets/1735392.pdf?src-supplier=Element14; Supplier Part Number 1: 445-6899-1-ND
NT1 NT2 = Net Tie Line: ClassName: Net Tie
Q1-Q3 = TRANS BC847CW,115 NPN 45V 0.1A SOT323: Bipolar (BJT) Transistor NPN 45V 100mA 100MHz 200mW Surface Mount SOT-323-3; Manufacturer: Nexperia; Supplier 1: Digi-Key; Manufacturer Part Number: BC847CW,115; Stock 1: 327256; Pricing 1: 1=0.13, 10=0.118, 25=0.1124, 100=0.0495, 250=0.0475, 500=0.0389, 1000=0.027 (USD); ComponentLink1URL: http://www.farnell.com/datasheets/1856333.pdf?src-supplier=Farnell; ComponentLink1Description: http://www.farnell.com/datasheets/1856333.pdf?src-supplier=Farnell; ComponentLink2URL: http://www.farnell.com/datasheets/1856333.pdf?src-supplier=Element14; ComponentLink2Description: http://www.farnell.com/datasheets/1856333.pdf?src-supplier=Element14; ComponentLink3URL: https://assets.nexperia.com/documents/data-sheet/BC847_SER.pdf?src-supplier=Digi-Key; ComponentLink3Description: https://assets.nexperia.com/documents/data-sheet/BC847_SER.pdf?src-supplier=Digi-Key; ComponentLink4URL: http://www.farnell.com/datasheets/1856333.pdf?src-supplier=Newark; ComponentLink4Description: http://www.farnell.com/datasheets/1856333.pdf?src-supplier=Newark; Supplier Part Number 1: 1727-4312-1-ND; ClassName: U_ESP32-WROOM32D_Module; Mount: Surface Mount
R1 = RES SMD 0 OHM JUMPER 1/16W 0402: 0 Ohms Jumper 0.063W, 1/16W Chip Resistor 0402 (1005 Metric) Moisture Resistant Thick Film; Manufacturer: Yageo; Manufacturer Part Number: RC0402JR-070RL; Power Rating: 62.5mW; Voltage Rating: 50V; Max Power Dissipation: 63mW; Temperature Coefficient: 200ppm/°C; Supplier 1: Digi-Key; Stock 1: 46057148; Pricing 1: 1=0.1, 10=0.013, 25=0.0092, 50=0.0072, 100=0.0053, 250=0.004, 500=0.0032, 1000=0.0024, 5000=0.0017 (USD); Contact Plating: Tin,Matte; Case Code (Metric): 1005; Case Code (Imperial): 0402; Min Operating Temperature: -55°C; Max Operating Temperature: 155°C; Packaging: Tape and Reel; Composition: Thick Film; Package Quantity: 1; Number of Terminations: 2; Termination: SMD/SMT; Military Standard: Not; Features: Moisture Resistant; Length: 1mm; Height: 0.016inch; Width: 0.02inch; Depth: 0.5mm; Radiation Hardening: No; REACH SVHC: Unknown; Lead Free: Lead Free; ComponentLink1URL: http://www.yageo.com/documents/recent/PYu-RC_Group_51_RoHS_L_10.pdf?src-supplier=Digi-Key; ComponentLink1Description: http://www.yageo.com/documents/recent/PYu-RC_Group_51_RoHS_L_10.pdf?src-supplier=Digi-Key; ComponentLink2URL: http://www.yageo.com/documents/recent/PYu-RC0402_51_RoHS_L_6.pdf?src-supplier=Avnet+Europe; ComponentLink2Description: http://www.yageo.com/documents/recent/PYu-RC0402_51_RoHS_L_6.pdf?src-supplier=Avnet+Europe; ComponentLink3URL: http://www.farnell.com/datasheets/1018594.pdf?src-supplier=Element14; ComponentLink3Description: http://www.farnell.com/datasheets/1018594.pdf?src-supplier=Element14; ComponentLink4URL: https://www.verical.com/server-webapp/html/getDatasheet?partID=326379&src-supplier=Verical; ComponentLink4Description: https://www.verical.com/server-webapp/html/getDatasheet?partID=326379&src-supplier=Verical; ComponentLink5URL: http://www.farnell.com/datasheets/2167052.pdf?src-supplier=Element14; ComponentLink5Description: http://www.farnell.com/datasheets/2167052.pdf?src-supplier=Element14; Supplier Part Number 1: 311-0.0JRCT-ND; Case/Package: 0402; ClassName: U_ESP32-WROOM32D_Module; Mount: Surface Mount
R2-R4 = RES SMD 10K OHM 1% 1/16W 0402: 10 kOhms ±1% 0.063W, 1/16W Chip Resistor 0402 (1005 Metric) Moisture Resistant Thick Film; Manufacturer Part Number: RC0402FR-0710KP; Manufacturer: Yageo; Temperature Coefficient: 150ppm/°C; Max Power Dissipation: 63mW; Supplier 1: Digi-Key; Stock 1: 839368; Pricing 1: 1=0.1, 10=0.035, 100=0.014, 1000=0.0063, 2500=0.0055, 5000=0.0045 (USD); Case Code (Imperial): 0402; Case Code (Metric): 1005; Min Operating Temperature: -55°C; Max Operating Temperature: 155°C; Composition: Thick Film; Packaging: Tape and Reel; Number of Terminations: 2; Length: 0.039inch; Height: 0.016inch; Width: 0.02inch; ComponentLink1URL: http://www.yageo.com/NewPortal/yageodocoutput?fileName=/pdf/R-Chip/PYu-RC_51_RoHS_P_0.pdf&src-supplier=Digi-Key; ComponentLink1Description: http://www.yageo.com/NewPortal/yageodocoutput?fileName=/pdf/R-Chip/PYu-RC_51_RoHS_P_0.pdf&src-supplier=Digi-Key; Supplier Part Number 1: YAG1249CT-ND; Case/Package: 0402; Features: Moisture Resistant; ClassName: U_ESP32-WROOM32D_Module; Mount: Surface Mount
R5 R6 = RES SMD 100 OHM 1% 1/16W 0402: 100 Ohms ±1% 0.063W, 1/16W Chip Resistor 0402 (1005 Metric) Moisture Resistant Thick Film; Manufacturer: Yageo; Manufacturer Part Number: RC0402FR-07100RL; Power Rating: 62.5mW; Voltage Rating: 50V; Temperature Coefficient: 100ppm/°C; Supplier 1: Digi-Key; Stock 1: 16989760; Pricing 1: 1=0.1, 10=0.016, 100=0.0064, 1000=0.0029, 2500=0.0025, 5000=0.0021 (USD); Case Code (Metric): 1005; Case Code (Imperial): 0402; Min Operating Temperature: -55°C; Max Operating Temperature: 155°C; Packaging: Tape and Reel; Composition: Thick Film; Termination: SMD/SMT; Military Standard: Not; Length: 1mm; Height: 0.32mm; Width: 0.5mm; Depth: 0.5mm; REACH SVHC: No SVHC; Lead Free: Lead Free; ComponentLink1URL: http://www.farnell.com/datasheets/2167052.pdf?src-supplier=Element14; ComponentLink1Description: http://www.farnell.com/datasheets/2167052.pdf?src-supplier=Element14; ComponentLink2URL: http://www.yageo.com/documents/recent/PYu-RC_Group_51_RoHS_L_9.pdf?src-supplier=Mouser; ComponentLink2Description: http://www.yageo.com/documents/recent/PYu-RC_Group_51_RoHS_L_9.pdf?src-supplier=Mouser; ComponentLink3URL: http://www.yageo.com/documents/recent/PYu-RC0402_51_RoHS_L_6_r.pdf?src-supplier=Future+Electronics; ComponentLink3Description: http://www.yageo.com/documents/recent/PYu-RC0402_51_RoHS_L_6_r.pdf?src-supplier=Future+Electronics; ComponentLink4URL: https://www.verical.com/server-webapp/html/getDatasheet?partID=329466&src-supplier=Verical; ComponentLink4Description: https://www.verical.com/server-webapp/html/getDatasheet?partID=329466&src-supplier=Verical; ComponentLink5URL: http://www.farnell.com/datasheets/1018594.pdf?src-supplier=Element14; ComponentLink5Description: http://www.farnell.com/datasheets/1018594.pdf?src-supplier=Element14; Supplier Part Number 1: 311-100LRDKR-ND; Case/Package: 0402; Number of Pins: 2; Voltage Rating (DC): 50V; ComponentLink6URL: http://documents.rs-components.com/techlib://itc_doclist_GB.htm?stockno=6185810&src-supplier=RSComponents; ComponentLink6Description: http://documents.rs-components.com/techlib://itc_doclist_GB.htm?stockno=6185810&src-supplier=RSComponents
R7 R8 R13 R14 = RES SMD 2.7K OHM 1% 1/16W 0402: 2.7 kOhms ±1% 0.063W, 1/16W Chip Resistor 0402 (1005 Metric) Moisture Resistant Thick Film; Manufacturer Part Number: RC0402FR-072K7L; Manufacturer: Yageo; Temperature Coefficient: 100ppm/°C; Voltage Rating: 50V; Power Rating: 63mW; Supplier 1: Digi-Key; Stock 1: 261850; Pricing 1: 1=0.1, 10=0.016, 100=0.0064, 1000=0.0029, 2500=0.0025, 5000=0.0021 (USD); Case Code (Imperial): 0402; Case Code (Metric): 1005; Min Operating Temperature: -55°C; Max Operating Temperature: 155°C; Composition: Thick Film; Packaging: Tape and Reel; Termination: SMD/SMT; Military Standard: Not; Working Voltage: 50V; Number of Terminations: 2; Length: 1mm; Height: 0.016inch; Width: 0.02inch; Depth: 0.5mm; REACH SVHC: Unknown; Lead Free: Lead Free; ComponentLink1URL: http://www.mouser.com/ds/2/447/PYu-RC0402_51_RoHS_L_6_r-8721.pdf?src-supplier=Mouser; ComponentLink1Description: http://www.mouser.com/ds/2/447/PYu-RC0402_51_RoHS_L_6_r-8721.pdf?src-supplier=Mouser; ComponentLink2URL: http://www.yageo.com/documents/recent/PYu-RC_Group_51_RoHS_L_9.pdf?src-supplier=Digi-Key; ComponentLink2Description: http://www.yageo.com/documents/recent/PYu-RC_Group_51_RoHS_L_9.pdf?src-supplier=Digi-Key; ComponentLink3URL: http://www.yageo.com/documents/recent/PYu-RC_Group_51_RoHS_L_10.pdf?src-supplier=Digi-Key; ComponentLink3Description: http://www.yageo.com/documents/recent/PYu-RC_Group_51_RoHS_L_10.pdf?src-supplier=Digi-Key; ComponentLink4URL: http://www.farnell.com/datasheets/2167052.pdf?src-supplier=Element14; ComponentLink4Description: http://www.farnell.com/datasheets/2167052.pdf?src-supplier=Element14; Supplier Part Number 1: 311-2.70KLRCT-ND; Case/Package: 0402; Package Quantity: 1; Max Power Dissipation: 63mW; Features: Moisture Resistant; ClassName: U_ESP32-WROOM32D_Module
R9-R12 = RES SMD 100K OHM 1% 1/16W 0402: 100 kOhms ±1% 0.063W, 1/16W Chip Resistor 0402 (1005 Metric) Moisture Resistant Thick Film; Manufacturer: Yageo; Manufacturer Part Number: RC0402FR-07100KL; Temperature Coefficient: 100ppm/°C; Power Rating: 63mW; Voltage Rating: 50V; Supplier 1: Digi-Key; Stock 1: 47448883; Pricing 1: 1=0.1, 10=0.016, 100=0.0064, 1000=0.0029, 2500=0.0025, 5000=0.0021 (USD); Case Code (Metric): 1005; Case Code (Imperial): 0402; Min Operating Temperature: -55°C; Max Operating Temperature: 155°C; Composition: Thick Film; Packaging: Tape and Reel; Package Quantity: 1; Number of Terminations: 2; Termination: SMD/SMT; Military Standard: Not; Max Power Dissipation: 63mW; Working Voltage: 50V; Features: Moisture Resistant; Length: 0.039inch; Height: 0.016inch; Width: 0.02inch; Depth: 0.5mm; REACH SVHC: No SVHC; Lead Free: Lead Free; ComponentLink1URL: http://www.yageo.com/documents/recent/PYu-RC_Group_51_RoHS_L_10.pdf?src-supplier=Digi-Key; ComponentLink1Description: http://www.yageo.com/documents/recent/PYu-RC_Group_51_RoHS_L_10.pdf?src-supplier=Digi-Key; ComponentLink2URL: http://www.farnell.com/datasheets/1018594.pdf?src-supplier=Element14; ComponentLink2Description: http://www.farnell.com/datasheets/1018594.pdf?src-supplier=Element14; ComponentLink3URL: http://www.yageo.com/documents/recent/PYu-RC_Group_51_RoHS_L_9.pdf?src-supplier=Verical; ComponentLink3Description: http://www.yageo.com/documents/recent/PYu-RC_Group_51_RoHS_L_9.pdf?src-supplier=Verical; ComponentLink4URL: http://www.yageo.com/documents/recent/PYu-RC_Group_51_RoHS_L_9.pdf?src-supplier=Mouser; ComponentLink4Description: http://www.yageo.com/documents/recent/PYu-RC_Group_51_RoHS_L_9.pdf?src-supplier=Mouser; ComponentLink5URL: http://documents.rs-components.com/techlib://itc_doclist_GB.htm?stockno=6185797&src-supplier=RSComponents; ComponentLink5Description: http://documents.rs-components.com/techlib://itc_doclist_GB.htm?stockno=6185797&src-supplier=RSComponents; Supplier Part Number 1: 311-100KLRDKR-ND; Case/Package: 0402; Tolerance: 1%

## Sheet SIT1533_Oscillator.SchDoc: SIT1533 RTC 32.768 kHz Oscillator
size A4; DocumentNumber: 3; SheetNumber: 3; SheetTotal: 31
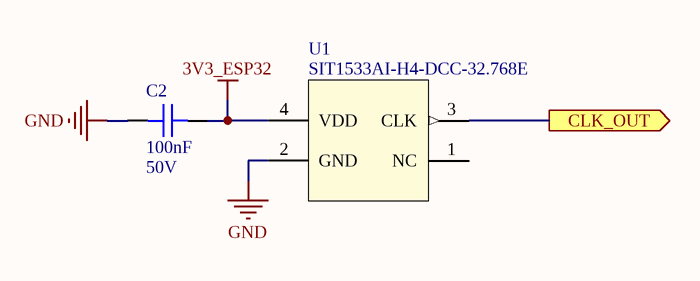
[diagram p9: SIT1533_Oscillator.SchDoc]

### Parts
C2  Capacitance: 100nF  Voltage: 50V  [C0402]  (hidden comment: CAP CER 0.1UF 50V X7R 0402)
U1  Manufacturer Part Number: SIT1533AI-H4-DCC-32.768E  [XTAL4_SiT1533_SIT]  (hidden comment: IC SIT1533AI-H4-DCC-32.768E MEMS OSC XO 32.7680KHZ LVCMOS)

### Ports
CLK_OUT (out)

### Nets
3V3_ESP32: C2.2 U1.4(VDD)
GND: C2.1 U1.2(GND)
GPIO33: U1.3(CLK) ; port CLK_OUT

Not connected (* = marked no-connect by the designer): U1 1(NC)

### Notes on the sheet
- Title
- Size:
- Date:
- A4
- Number:
- Time:
- Revision:
- Sheet
- of
- File:

### Library data of the parts
C2 = CAP CER 0.1UF 50V X7R 0402: as C15 on sheet Membrane_Keypad; Supplier 1: Digi-Key; Stock 1: 2925303; Pricing 1: 1=0.17, 10=0.118, 50=0.0668, 100=0.0553, 500=0.0388, 1000=0.0321, 2500=0.0299, 5000=0.0273 (USD); Mount: Surface Mount; Case/Package: 0402; Weight: 2.3E-05oz; Case Code (Metric): 1005; Case Code (Imperial): 0402; Min Operating Temperature: -55°C; Max Operating Temperature: 125°C; Voltage Rating: 50V; Tolerance: 10%; Packaging: Tape and Reel; Package Quantity: 1; Voltage Rating (DC): 50V; Dielectric: X7R; Termination: SMD/SMT; Composition: Ceramic; Length: 1mm; Height: 0.5mm; Width: 0.02inch; Thickness: 0.022inch; Depth: 0.5mm; Ratings: AEC-Q200; REACH SVHC: No SVHC; Lead Free: Lead Free; ComponentLink1URL: http://product.tdk.com/capacitor/mlcc/en/documents/mlccspec_automotive_general_midvoltage_en.pdf?src-supplier=Future+Electronics; ComponentLink1Description: http://product.tdk.com/capacitor/mlcc/en/documents/mlccspec_automotive_general_midvoltage_en.pdf?src-supplier=Future+Electronics; ComponentLink2URL: http://www.farnell.com/datasheets/1807242.pdf?src-supplier=Element14; ComponentLink2Description: http://www.farnell.com/datasheets/1807242.pdf?src-supplier=Element14; ComponentLink3URL: http://www.mouser.com/ds/2/400/lcc_automotive_general_en-843974.pdf?src-supplier=Mouser; ComponentLink3Description: http://www.mouser.com/ds/2/400/lcc_automotive_general_en-843974.pdf?src-supplier=Mouser; ComponentLink4URL: http://www.farnell.com/datasheets/1936565.pdf?src-supplier=Element14; ComponentLink4Description: http://www.farnell.com/datasheets/1936565.pdf?src-supplier=Element14; ComponentLink5URL: http://www.farnell.com/datasheets/1735392.pdf?src-supplier=Element14; ComponentLink5Description: http://www.farnell.com/datasheets/1735392.pdf?src-supplier=Element14; Supplier Part Number 1: 445-6899-1-ND; ClassName: MCU
U1 = IC SIT1533AI-H4-DCC-32.768E MEMS OSC XO 32.7680KHZ LVCMOS: 32.768kHz XO (Standard) LVCMOS Oscillator 1.5V ~ 3.63V  4-SMD, No Lead; Manufacturer: SiTime; Frequency Stability: 100ppm; Max Supply Current: 1.4uA; Load Capacitance: 10pF; Current Rating: 1.35uA; Max Duty Cycle: 52%; Supplier 1: Digi-Key; Stock 1: 89278; Pricing 1: 1=1.1, 10=0.975, 50=0.9116, 100=0.8056, 500=0.7632 (USD); Mount: Surface Mount; Case/Package: SMD/SMT; Number of Pins: 4; Min Operating Temperature: -40°C; Max Operating Temperature: 85°C; Packaging: Tape and Reel; Frequency: 32.768kHz; Termination: SMD/SMT; Min Supply Voltage: 1.5V; Max Supply Voltage: 3.63V; Package Quantity: 1000; Length: 0.079inch; Width: 0.047inch; Height: 0.024inch; RoHS Compliant: Yes; ComponentLink1URL: https://www.sitime.com/datasheet/SiT1533?src-supplier=Digi-Key; ComponentLink1Description: https://www.sitime.com/datasheet/SiT1533?src-supplier=Digi-Key; ComponentLink2URL: http://www.mouser.com/ds/2/371/SiT1533-datasheet-275337.pdf?src-supplier=Mouser; ComponentLink2Description: http://www.mouser.com/ds/2/371/SiT1533-datasheet-275337.pdf?src-supplier=Mouser; ComponentLink3URL: http://components.arrow.com/part/dataview/0323_07137603?src-supplier=Arrow+Europe; ComponentLink3Description: http://components.arrow.com/part/dataview/0323_07137603?src-supplier=Arrow+Europe; Supplier Part Number 1: 1473-1239-1-ND; ClassName: MCU